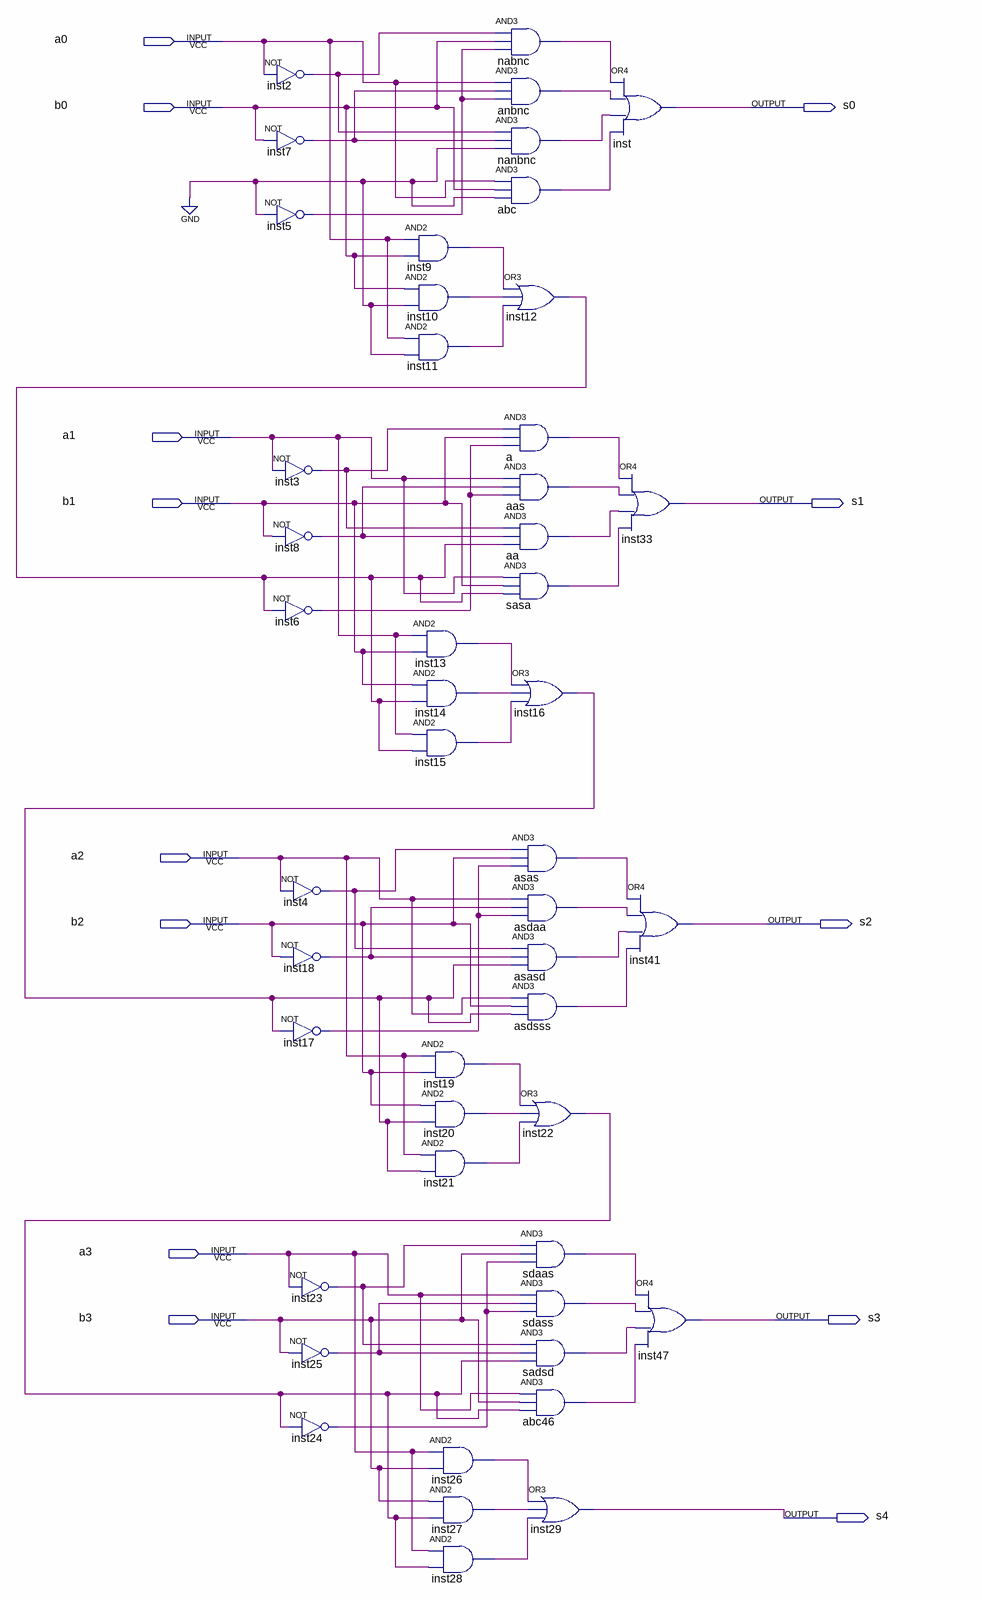
[diagram p0: schematic sheet]
// Quartus schematic ULAULA-SOMA-esquema.bdf as structural Verilog: 48 symbols, 13 pins
module \ULAULA-SOMA-esquema  (
  input  a0,
  input  b0,
  input  a1,
  input  b1,
  input  a2,
  input  b2,
  input  a3,
  input  b3,
  output s0,
  output s1,
  output s2,
  output s3,
  output s4
);

  wire a_out, aa_out, aas_out, abc46_out, abc_out, anbnc_out, asas_out, asasd_out, asdaa_out, asdsss_out,
       inst2_out, inst3_out, inst4_out, inst5_out, inst6_out, inst7_out, inst8_out, inst9_out, inst10_out,
       inst11_out, inst12_out, inst13_out, inst14_out, inst15_out, inst16_out, inst17_out, inst18_out,
       inst19_out, inst20_out, inst21_out, inst22_out, inst23_out, inst24_out, inst25_out, inst26_out,
       inst27_out, inst28_out, nabnc_out, nanbnc_out, sadsd_out, sasa_out, sdaas_out, sdass_out;

  not inst2 (inst2_out, a0);
  not inst7 (inst7_out, b0);
  not inst5 (inst5_out, 1'b0);
  not inst3 (inst3_out, a1);
  not inst8 (inst8_out, b1);
  not inst6 (inst6_out, inst12_out);
  not inst4 (inst4_out, a2);
  not inst18 (inst18_out, b2);
  not inst17 (inst17_out, inst16_out);
  not inst23 (inst23_out, a3);
  not inst25 (inst25_out, b3);
  not inst24 (inst24_out, inst22_out);
  and inst9 (inst9_out, a0, b0);
  and inst10 (inst10_out, b0, 1'b0);
  and inst11 (inst11_out, a0, 1'b0);
  and inst13 (inst13_out, a1, b1);
  and inst14 (inst14_out, b1, inst12_out);
  and inst15 (inst15_out, a1, inst12_out);
  and inst19 (inst19_out, a2, b2);
  and inst20 (inst20_out, b2, inst16_out);
  and inst21 (inst21_out, a2, inst16_out);
  and inst26 (inst26_out, a3, b3);
  and inst27 (inst27_out, b3, inst22_out);
  and inst28 (inst28_out, a3, inst22_out);
  and nabnc (nabnc_out, inst2_out, b0, inst5_out);
  and anbnc (anbnc_out, a0, inst7_out, inst5_out);
  and nanbnc (nanbnc_out, inst2_out, inst7_out, 1'b0);
  and abc (abc_out, a0, b0, 1'b0);
  or inst12 (inst12_out, inst9_out, inst10_out, inst11_out);
  and a (a_out, inst3_out, b1, inst6_out);
  and aas (aas_out, a1, inst8_out, inst6_out);
  and aa (aa_out, inst3_out, inst8_out, inst12_out);
  and sasa (sasa_out, a1, b1, inst12_out);
  or inst16 (inst16_out, inst13_out, inst14_out, inst15_out);
  and asas (asas_out, inst4_out, b2, inst17_out);
  and asdaa (asdaa_out, a2, inst18_out, inst17_out);
  and asasd (asasd_out, inst4_out, inst18_out, inst16_out);
  and asdsss (asdsss_out, a2, b2, inst16_out);
  or inst22 (inst22_out, inst19_out, inst20_out, inst21_out);
  and sdaas (sdaas_out, inst23_out, b3, inst24_out);
  and sdass (sdass_out, a3, inst25_out, inst24_out);
  and sadsd (sadsd_out, inst23_out, inst25_out, inst22_out);
  and abc46 (abc46_out, a3, b3, inst22_out);
  or inst29 (s4, inst26_out, inst27_out, inst28_out);
  or inst (s0, nabnc_out, anbnc_out, nanbnc_out, abc_out);
  or inst33 (s1, a_out, aas_out, aa_out, sasa_out);
  or inst41 (s2, asas_out, asdaa_out, asasd_out, asdsss_out);
  or inst47 (s3, sdaas_out, sdass_out, sadsd_out, abc46_out);
endmodule
